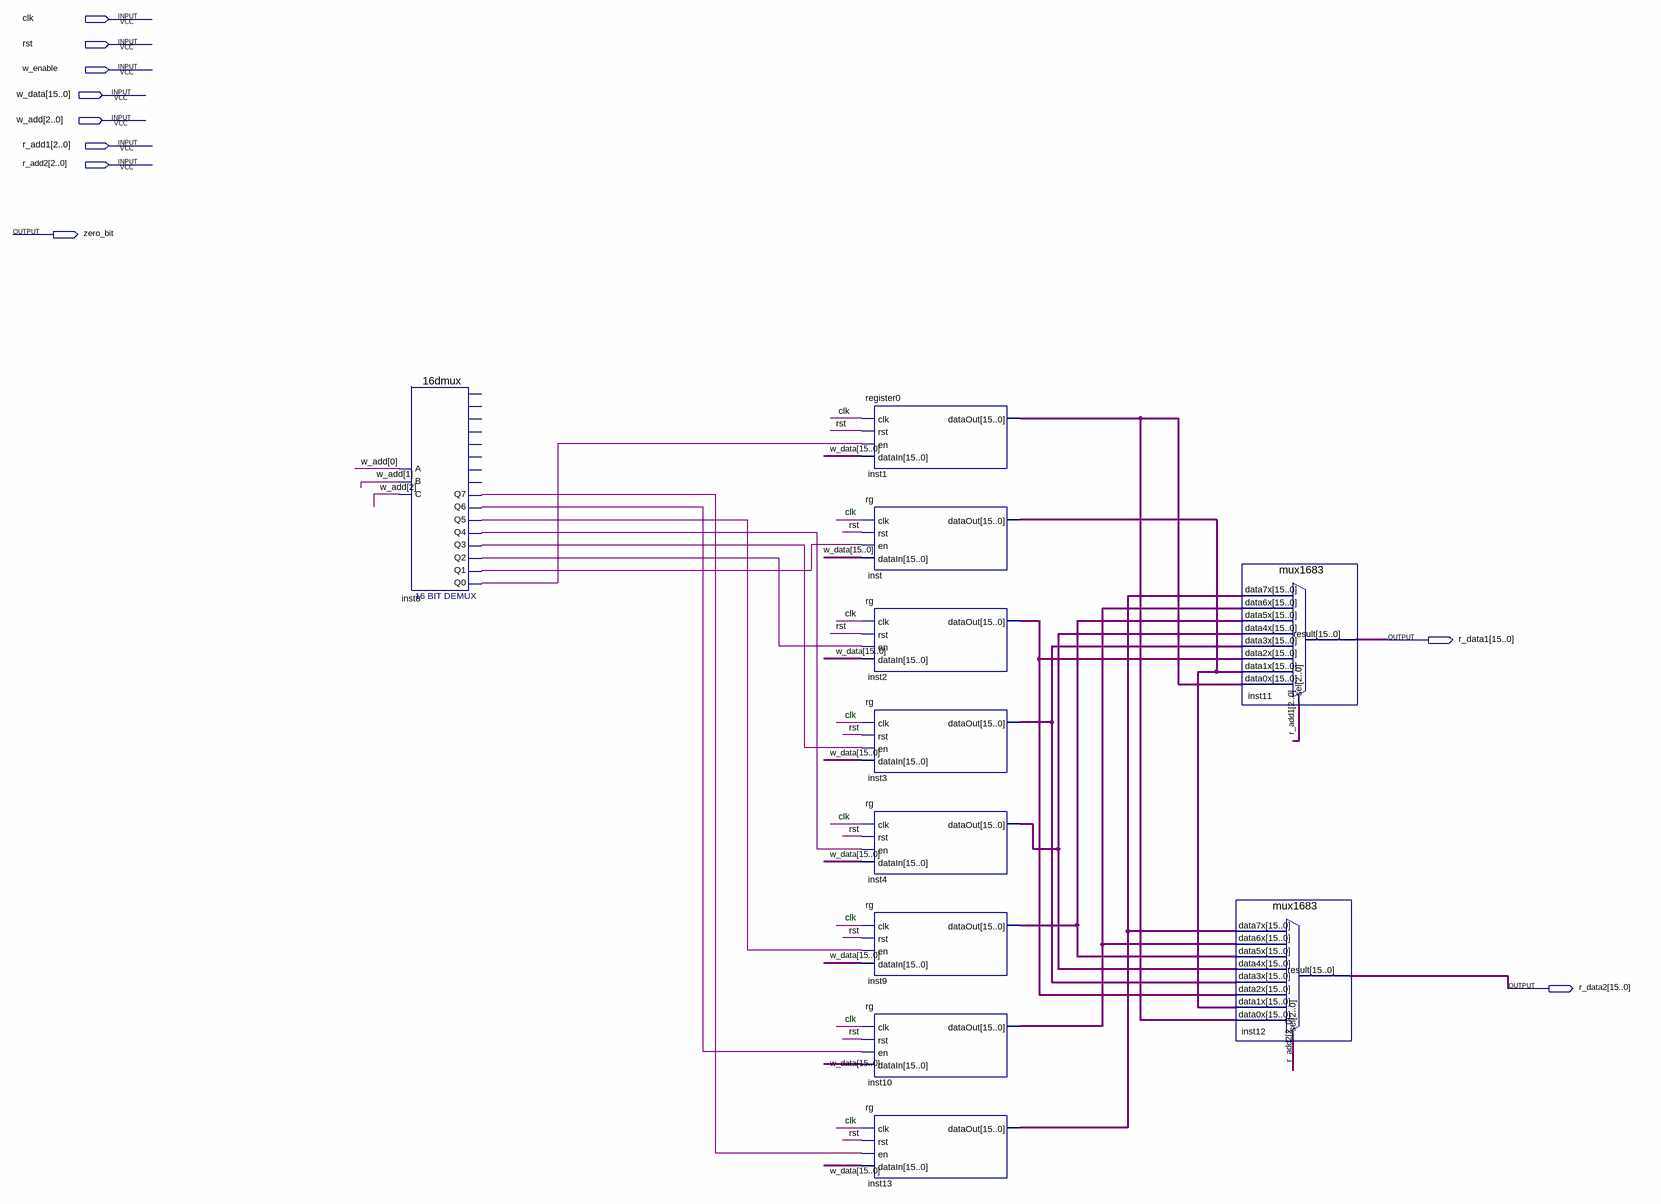
[diagram p0: schematic sheet]
// Quartus schematic rgfile.bdf as structural Verilog: 11 symbols, 10 pins
module rgfile (
  input  clk,
  input  rst,
  input  w_enable,
  input  [15:0] w_data,
  input  [2:0] w_add,
  input  [2:0] r_add1,
  input  [2:0] r_add2,
  output zero_bit,
  output [15:0] r_data1,
  output [15:0] r_data2
);

  wire inst8_q0, inst8_q1, inst8_q2, inst8_q3, inst8_q4, inst8_q5, inst8_q6, inst8_q7;
  wire [15:0] inst1_dataout, inst2_dataout, inst3_dataout, inst4_dataout, inst9_dataout, inst10_dataout,
       inst13_dataout, inst_dataout;

  \16dmux  inst8 (
    .A(w_add[0]), .B(w_add[1]), .C(w_add[2]), .Q0(inst8_q0), .Q1(inst8_q1), .Q2(inst8_q2), .Q3(inst8_q3),
    .Q4(inst8_q4), .Q5(inst8_q5), .Q6(inst8_q6), .Q7(inst8_q7));
  register0 inst1 (.clk(clk), .rst(rst), .en(inst8_q0), .dataIn(w_data), .dataOut(inst1_dataout));
  rg inst (.clk(clk), .rst(rst), .en(inst8_q1), .dataIn(w_data), .dataOut(inst_dataout));
  rg inst2 (.clk(clk), .rst(rst), .en(inst8_q2), .dataIn(w_data), .dataOut(inst2_dataout));
  rg inst3 (.clk(clk), .rst(rst), .en(inst8_q3), .dataIn(w_data), .dataOut(inst3_dataout));
  rg inst4 (.clk(clk), .rst(rst), .en(inst8_q4), .dataIn(w_data), .dataOut(inst4_dataout));
  rg inst9 (.clk(clk), .rst(rst), .en(inst8_q5), .dataIn(w_data), .dataOut(inst9_dataout));
  rg inst10 (.clk(clk), .rst(rst), .en(inst8_q6), .dataIn(w_data), .dataOut(inst10_dataout));
  rg inst13 (.clk(clk), .rst(rst), .en(inst8_q7), .dataIn(w_data), .dataOut(inst13_dataout));
  mux1683 inst11 (
    .data7x(inst13_dataout), .data6x(inst10_dataout), .data5x(inst9_dataout), .data4x(inst4_dataout),
    .data3x(inst3_dataout), .data2x(inst2_dataout), .data1x(inst_dataout), .data0x(inst1_dataout),
    .sel(r_add1), .result(r_data1));
  mux1683 inst12 (
    .data7x(inst13_dataout), .data6x(inst10_dataout), .data5x(inst9_dataout), .data4x(inst4_dataout),
    .data3x(inst3_dataout), .data2x(inst2_dataout), .data1x(inst_dataout), .data0x(inst1_dataout),
    .sel(r_add2), .result(r_data2));

  // Notes on the sheet:
  //   clk
  //   clk
  //   clk
  //   clk
  //   clk
  //   clk
endmodule
